# EAGLE design avip-mod v3 (EAGLE 9.6.2)
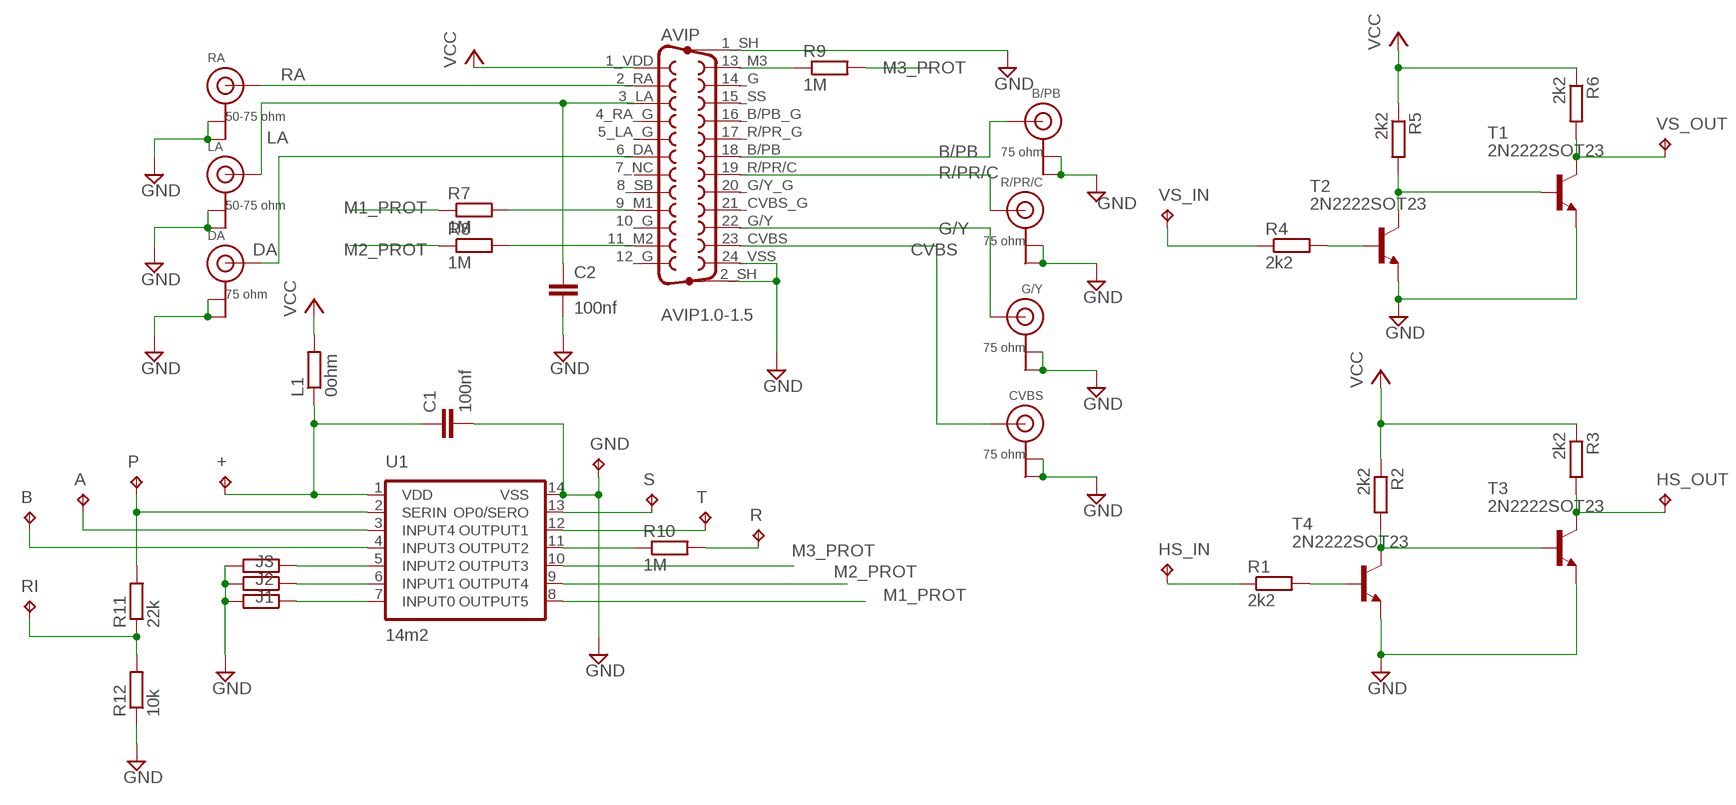
[diagram p0: schematic, sheet 1]

## Parts
+  TPTP07SQ  [TP07SQ]
A  TPTP07SQ  [TP07SQ]
AVIP  AVIP1.0-1.5  [AVIP-1.0-1.5]
B  TPTP07SQ  [TP07SQ]
B/PB  75 ohm  ANTENNA_U.FL  [U.FL]
C1  100nf  C-EUC0603  [C0603]
C2  100nf  C-EUC0603  [C0603]
CVBS  75 ohm  ANTENNA_U.FL  [U.FL]
DA  75 ohm  ANTENNA_U.FL  [U.FL]
G/Y  75 ohm  ANTENNA_U.FL  [U.FL]
GND  TPTP07SQ  [TP07SQ]
HS_IN  TPTP07SQ  [TP07SQ]
HS_OUT  TPTP07SQ  [TP07SQ]
J1  0ohm  R-EU_R0603  [R0603]
J2  0ohm  R-EU_R0603  [R0603]
J3  0ohm  R-EU_R0603  [R0603]
L1  0ohm  R-EU_R0603  [R0603]
LA  50-75 ohm  ANTENNA_U.FL  [U.FL]
P  TPTP07SQ  [TP07SQ]
R  TPTP07SQ  [TP07SQ]
R1  2k2  R-EU_R0603  [R0603]
R2  2k2  R-EU_R0603  [R0603]
R3  2k2  R-EU_R0603  [R0603]
R4  2k2  R-EU_R0603  [R0603]
R5  2k2  R-EU_R0603  [R0603]
R6  2k2  R-EU_R0603  [R0603]
R7  1M  R-EU_R0603  [R0603]
R8  1M  R-EU_R0603  [R0603]
R9  1M  R-EU_R0603  [R0603]
R10  1M  R-EU_R0603  [R0603]
R11  22k  R-EU_R0603  [R0603]
R12  10k  R-EU_R0603  [R0603]
R/PR/C  75 ohm  ANTENNA_U.FL  [U.FL]
RA  50-75 ohm  ANTENNA_U.FL  [U.FL]
RI  TPTP07SQ  [TP07SQ]
S  TPTP07SQ  [TP07SQ]
T  TPTP07SQ  [TP07SQ]
T1  2N2222SOT23  [SOT23]
T2  2N2222SOT23  [SOT23]
T3  2N2222SOT23  [SOT23]
T4  2N2222SOT23  [SOT23]
U1  14m2  PICAXE-14AXE017M2SM  [SO14]
VS_IN  TPTP07SQ  [TP07SQ]
VS_OUT  TPTP07SQ  [TP07SQ]

## Nets
A: A.TP U1.3(INPUT4)
B: B.TP U1.4(INPUT3)
B/PB [video length]: AVIP.18_B/PB B/PB.3(SIGNAL)
CVBS: AVIP.23_CVBS CVBS.3(SIGNAL)
DA: AVIP.6_DA DA.3(SIGNAL)
G/Y [video length]: AVIP.22_G/Y G/Y.3(SIGNAL)
GND: AVIP.1_SH AVIP.2_SH AVIP.24_VSS B/PB.1(GND) B/PB.2(GND) C1.2 C2.2 CVBS.1(GND) CVBS.2(GND) DA.1(GND) DA.2(GND) G/Y.1(GND) G/Y.2(GND) GND.TP J1.2 J2.2 J3.2 LA.1(GND) LA.2(GND) R12.1 R/PR/C.1(GND) R/PR/C.2(GND) RA.1(GND) RA.2(GND) T1.3(E) T2.3(E) T3.3(E) T4.3(E) U1.14(VSS)
H_SYNC_3V: R2.2 T3.1(B) T4.2(C)
H_SYNC_IN: HS_IN.TP R1.1
H_SYNC_IN_PROT: R1.2 T4.1(B)
H_SYNC_OUT: HS_OUT.TP R3.2 T3.2(C)
LA: AVIP.3_LA C2.1 LA.3(SIGNAL)
M1: AVIP.9_M1 R7.2
M1_PROT: R7.1 U1.8(OUTPUT5)
M1S: J1.1 U1.7(INPUT0)
M2: AVIP.11_M2 R8.2
M2_PROT: R8.1 U1.9(OUTPUT4)
M2S: J2.1 U1.6(INPUT1)
M3: AVIP.13_M3 R9.1
M3_PROT: R9.2 U1.10(OUTPUT3)
M3S: J3.1 U1.5(INPUT2)
PROG: P.TP R11.2 U1.2(SERIN)
R/PR/C [video length]: AVIP.19_R/PR/C R/PR/C.3(SIGNAL)
RA: AVIP.2_RA RA.3(SIGNAL)
RESET: R10.2 R.TP
RESET_PROT: R10.1 U1.11(OUTPUT2)
RING: R11.1 R12.2 RI.TP
SPEAK: S.TP U1.13(OP0/SERO)
TOGGLE: T.TP U1.12(OUTPUT1)
V_SYNC_3V: R5.2 T1.1(B) T2.2(C)
V_SYNC_IN: R4.1 VS_IN.TP
V_SYNC_IN_PROT: R4.2 T2.1(B)
V_SYNC_OUT: R6.2 T1.2(C) VS_OUT.TP
VCC: AVIP.1_VDD L1.2 R2.1 R3.1 R5.1 R6.1
VDD: +.TP C1.1 L1.1 U1.1(VDD)
Unconnected: AVIP.4_RA_G AVIP.5_LA_G AVIP.7_NC AVIP.8_SB AVIP.10_G AVIP.12_G AVIP.14_G AVIP.15_SS AVIP.16_B/PB_G AVIP.17_R/PR_G AVIP.20_G/Y_G AVIP.21_CVBS_G

## Library data of the parts
+ A B GND HS_IN HS_OUT P R RI S T VS_IN VS_OUT = testpad:TP: Test pad
AVIP = XBOX:AVIP
B/PB CVBS DA G/Y LA R/PR/C RA = adafruit:ANTENNA_U.FL: U.FL Antenna Connector
C1 C2 = rcl:C-EU: CAPACITOR, European symbol; SPICEPREFIX: C
J1-J3 L1 R1-R12 = rcl:R-EU_: RESISTOR, European symbol; SPICEPREFIX: R
T1-T4 = adafruit:2N2222: NPN TRANSISTOR Big oval pads
U1 = picaxe-4:PICAXE-14

## Net classes
0 standard: width 0.25 mm, clearance 0.205 mm
1 video length: width 0.006 mm

## Board
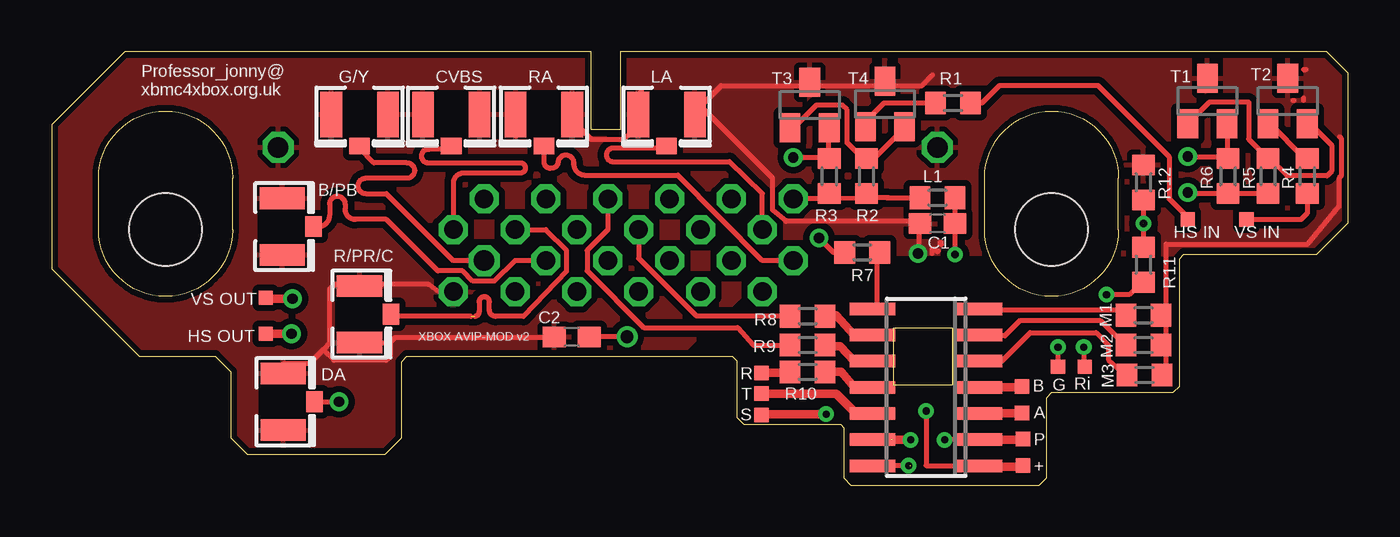
[diagram p1: board, top side]
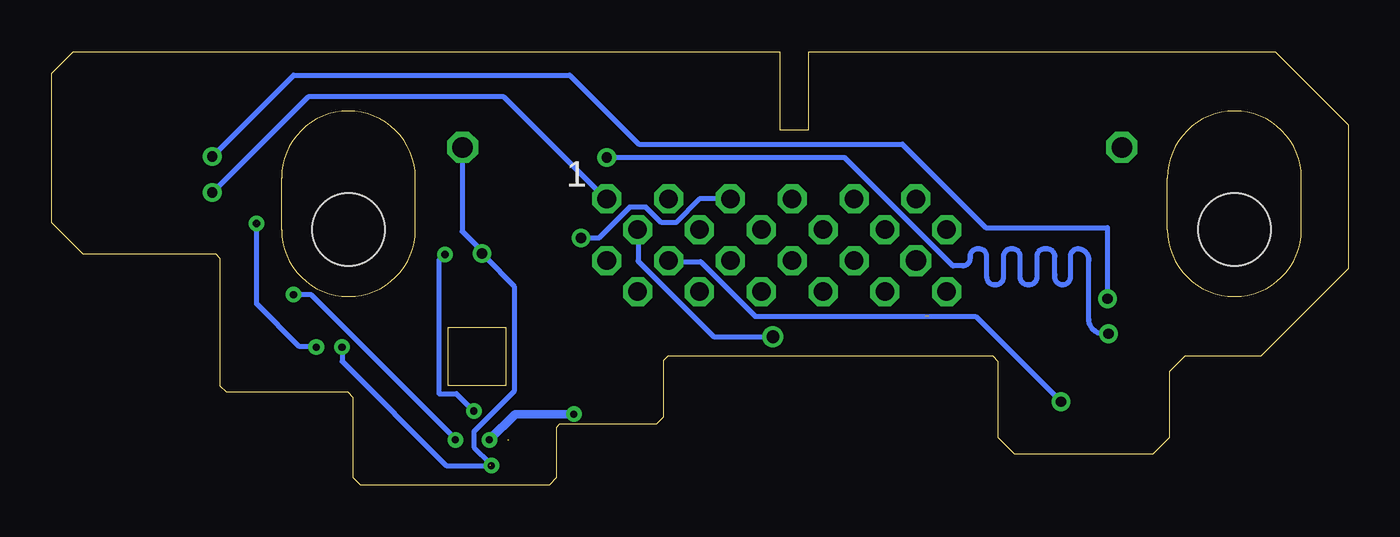
[diagram p2: board, bottom side, seen from below]

Size 62.95 x 21.05 mm. Coordinates in mm from the lower left corner, seen from the top.
Outline: 33.05,6.25 33.25,6.05 33.25,3.3 33.6,2.95 38.3,2.95 38.45,2.8 38.45,0.35 38.8,0 47.95,0 48.3,0.35 48.3,4.25 48.55,4.5 54.45,4.5 54.75,4.8 54.75,11 54.95,11.2 61.4,11.2 62.95,12.75 62.95,20 61.9,21.05 27.6,21.05 27.6,17.25 26.2,17.25 26.2,21.05 3.55,21.05 0,17.5 0,10.5 4.25,6.25 7.95,6.25 8.7,5.5 8.7,2.3 9.5,1.5 16.2,1.5 17,2.3 17,6 17.25,6.25 33.05,6.25
Copper layers (1*16): Top 0.035mm / dielectric 1.5mm / Bottom 0.035mm
Design rules "default *": minimum track width 10mil, minimum drill 24mil, track to track 8mil, track to pad 8mil, pad to pad 8mil, via to via 8mil, smd to smd 8mil, copper to edge 8mil, drill to drill 8mil, minimum pad ring 10mil, minimum via ring 8mil, stop-mask expansion 4mil, vias tented up to drill 15mil, thermal gap 10mil
Milling: 4 lines

### Footprints (pad centres in the part's own frame; a part is rotated, then mirrored left to right if it is on the bottom)
TP07SQ = smd 0.7 x 0.7: TP 0,0
AVIP-1.0-1.5 = drill 1 octagon: 1_SH -35.5,7; 2_SH -3.5,7; 22_G/Y -13.5,1.5 | drill 0.9 octagon: 1_VDD -28.5,4.5; 2_RA -28.5,1.5; 3_LA -27,3; 4_RA_G -27,0; 5_LA_G -25.5,4.5; 6_DA -25.5,1.5; 7_NC -24,3; 8_SB -24,0; 9_M1 -22.5,4.5; 10_G -22.5,1.5; 11_M2 -21,3; 12_G -21,0; 13_M3 -19.5,4.5; 14_G -19.5,1.5; 15_SS -18,3; 16_B/PB_G -18,0; 17_R/PR_G -16.5,4.5; 18_B/PB -16.5,1.5; 19_R/PR/C -15,3; 20_G/Y_G -15,0; 21_CVBS_G -13.5,4.5; 23_CVBS -12,3; 24_VSS -12,0 | hole 3.5: -41.035,3.01; 1.965,3.01
U.FL = smd 2.2 x 1.05: 1 0,1.375; 2 0,-1.375 | smd 0.8 x 1: 3 1.525,0
C0603 = smd 1.1 x 1: 1 -0.85,0; 2 0.85,0
R0603 = smd 1 x 1.1: 1 -0.85,0; 2 0.85,0
SOT23 = smd 1 x 1.4: 1 -0.95,-1.1; 2 0.95,-1.1; 3 0,1.1
SO14 = smd 0.6 x 2.2: 1 -3.81,-2.6; 2 -2.54,-2.6; 3 -1.27,-2.6; 4 0,-2.6; 5 1.27,-2.6; 6 2.54,-2.6; 7 3.81,-2.6; 8 3.81,2.6; 9 2.54,2.6; 10 1.27,2.6; 11 0,2.6; 12 -1.27,2.6; 13 -2.54,2.6; 14 -3.81,2.6

### Placement (x,y rotation side)
+  47.15,0.95 0 top
A  47.1,3.5 0 top
AVIP  7.5,9.4 0 bottom
B  47.1,4.8 0 top
B/PB  11.2,12.55 0 top
C1  43,12.7 180 top
C2  25.25,7.2 180 top
CVBS  19.4,18 270 top
DA  11.25,4.05 0 top
G/Y  14.95,18 270 top
GND  48.85,5.75 0 top
HS_IN  55.15,12.9 180 top
HS_OUT  10.4,7.35 180 top
J1  53,8.25 0 top
J2  53,6.8 0 top
J3  53.05,5.35 0 top
L1  43,13.95 180 top
LA  29.85,18 270 top
P  47.15,2.25 0 top
R  34.45,5.45 0 top
R1  43.75,18.55 180 top
R2  39.55,15 90 top
R3  37.75,15 90 top
R4  60.95,15 90 top
R5  59.05,15 90 top
R6  57.1,15 90 top
R7  39.35,11.3 180 top
R8  36.7,8.2 180 top
R9  36.7,6.8 0 top
R10  36.7,5.5 180 top
R11  53,10.7 270 top
R12  53,14.7 270 top
R/PR/C  14.95,8.3 0 top
RA  23.9,18 270 top
RI  50.15,5.75 0 top
S  34.45,3.4 0 top
T  34.45,4.45 0 top
T1  56.1,18.65 0 top
T2  60,18.65 0 top
T3  36.8,18.45 0 top
T4  40.45,18.5 0 top
U1  42.45,4.75 90 top
VS_IN  58,12.9 180 top
VS_OUT  10.4,9.1 180 top

### Tracks (layer width: path | path; a pad name or v marks a point on that pad's centre or on a via)
A
  Top 0.254: A.TP 47.1,3.53 47.05,3.5 | 45.3,3.5 45.15,3.53 U1.3
  Top 0.406: 45.3,3.5 47.05,3.5
B
  Top 0.254: B.TP 47.1,4.75 | 45.15,4.75 45.15,4.8 U1.4
  Top 0.406: U1.4 45.15,4.75 47.1,4.75
B/PB
  Top 0.254: AVIP.18_B/PB 22.5,10.9 21.5,9.9 20.45,9.9 19.95,10.4 18.75,10.4 16.25,12.9 14.75,12.9 arc-90 14.25,13.4 14.25,13.65 arc180 13.5,13.65 13.5,13.1 arc-90 12.95,12.55 12.8,12.55 12.68,12.6 B/PB.3
CVBS
  Top 0.254: AVIP.23_CVBS 19.5,14.65 arc-90 20,15.15 22.75,15.15 arc180 22.75,15.65 18.25,15.65 arc-180 18.32,16.3 19.45,16.3 19.45,16.39 CVBS.3
DA  (via drill 0.5)
  Top 0.254: DA.3 v13.95,4.05
  Bottom 0.254: v13.95,4.05 18.1,8.2 28.8,8.2 31.45,10.85 32.92,10.85 32.99,10.88 AVIP.6_DA
G/Y
  Top 0.254: AVIP.22_G/Y 19.5,10.9 16.25,14.15 15.25,14.15 arc-180 15.25,14.9 17.25,14.9 arc180 17.25,15.65 15.65,15.65 14.95,16.35 14.98,16.39 G/Y.3
GND  (via drill 0.35, 0.5)  (1 unrouted)
  Top 0.254: 42.75,19.9 42.25,19.4 32.5,19.4 31.5,18.4 35,14.9 35,13.35 35.65,12.8 35.74,12.83 41.86,12.83 C1.2 42.1,12.71 42.1,11.3 v42.05,11.25 42.28,11.34 42.28,11.25 | 54.1,6.86 54.1,5.37 53.99,5.37 J3.2 | 54.1,6.86 54.1,8.35 | 54.1,8.35 54.1,11.7 60.97,11.7 62.45,13.5 62.48,13.52 62.48,14.9 62.6,15.01 62.6,16.85 62.52,16.91 | AVIP.24_VSS 18.8,9.4 18.3,9.75 13.75,9.75 13.48,9.48 13.48,6.98 13.53,6.93 13.19,6.59 | 15.8,6.85 15.85,6.9 16.45,6.9 16.45,6.27 16.24,6.06 13.71,6.06 13.19,6.59 | 13.19,6.59 12.5,5.9 11.25,5.9 | 41.67,0.95 40.65,0.95 40.56,1.01 39.88,1.01 U1.14 | v48.85,6.7 GND.TP | 54.1,8.35 53.88,8.35 J1.2 | 54.1,6.86 53.88,6.86 J2.2 | 28.63,19.14 28.6,19.14 | 31.61,17.99 LA.1 | 31.15,17.07 LA.1 | 31.38,18.11 LA.1 | 36.66,19.6 T3.3 | 60.76,20.17 60.88,20.17 | 60.76,18.8 60.76,18.68 | 25.27,17.47 RA.1 25.27,17.7 25.67,17.3 25.67,17.31 26.2,16.79 27.79,16.79 28.2,17.2 28.17,17.3 28.17,17.76 28.4,17.99 LA.2 | 22.55,16.96 RA.2 | 41.66,0.96 v41.6,0.95 | 42.86,11.47 42.74,11.45 42.74,11.25 | 42.97,11.34 43.04,11.36 | 43.17,11.78 43.12,11.77 43.2,11.68 | 24.61,7.15 16.65,7.15 16.43,6.93 | 60.3,18.68 60.26,18.67 | T2.3 59.96,19.71 59.88,19.63
  Bottom 0.254: v48.85,6.7 48.85,6.01 43.79,0.95 v41.6,0.95 41.75,0.98 41.66,1.06 42.45,1.85 42.45,2.6 40.5,4.55 40.5,9.65 41.9,11.1 v42.05,11.25 42,11.3 43.02,12.32 43.02,16.38 AVIP.1_SH
  pour Top (isolate 0.305): 0,17.5 0,10.5 4.23,6.25 7.93,6.23 8.7,5.5 8.74,2.29 9.5,1.52 16.26,1.52 17,2.32 17.01,5.98 17.29,6.25 30.37,6.26 35.56,11.26 61.4,11.2 62.95,12.8 62.95,19.95 61.95,21.05 27.6,21.05 27.6,17.25 26.2,17.25 26.2,21.05 3.55,21
H_SYNC_3V
  Top 0.254: T4.2 41.37,17.3 39.99,15.93 39.73,15.93 R2.2 39.14,16.08 38.61,16.62 38.61,18.22 38.38,18.45 37.12,18.45 36.09,17.42 35.86,17.42 T3.1
H_SYNC_IN
  Top 0.254: HS_IN.TP 55.15,13 54.25,13.9 54.25,15.95 50.8,19.4 46,19.4 45.15,18.55 R1.1
H_SYNC_IN_PROT
  Top 0.254: R1.2 40.4,18.55 39.5,17.65 T4.1
H_SYNC_OUT  (via drill 0.5 pad 0.25)
  Top 0.254: v36,15.9 37.7,15.9 R3.2 37.71,15.89 37.71,17.31 T3.2
  Top 0.406: v11.65,7.35 HS_OUT.TP
  Bottom 0.254: v11.65,7.35 11.91,7.35 arc90 12.6,8.04 12.6,10.9 arc-90 13.12,11.48 | 13.12,11.48 13.12,11.48 arc0 13.12,11.48 | 13.12,11.48 arc-90 13.5,11.1 13.5,10.11 arc90 13.88,9.72 13.93,9.72 arc90 14.25,10.22 14.25,11.11 arc-90 14.7,11.48 14.74,11.48 arc-90 15.12,11.1 15.12,10.11 arc90 15.51,9.72 15.55,9.72 arc90 15.94,10.11 15.94,11.1 arc-90 16.32,11.48 16.37,11.48 arc-90 16.75,11.1 16.75,10.11 arc90 17.13,9.72 17.18,9.72 arc90 17.56,10.11 17.56,11.1 arc-90 17.94,11.48 17.99,11.48 arc-90 18.37,11.1 18.37,11 arc90 18.72,10.65 19.2,10.65 24.45,15.9 v36,15.9
LA  (via drill 0.61)
  Top 0.254: AVIP.3_LA 34.5,14.15 32.9,15.7 27.2,15.7 arc-143 27.15,16.35 29.74,16.35 29.78,16.5 LA.3 | v27.94,7.21 C2.1
  Bottom 0.254: v27.94,7.21 30.81,7.21 34.48,10.88 34.48,12.37 AVIP.3_LA
M1  (via drill 0.5)
  Top 0.254: v37.25,12 37.95,11.3 R7.2 | R7.2 38.5,11.34 R7.2
  Bottom 0.254: v37.25,12 36.38,12 34.9,13.5 34.1,13.5 33.35,12.75 32.65,12.75 31.5,13.9 AVIP.9_M1 30.01,13.86 AVIP.9_M1
M1_PROT
  Top 0.254: R7.1 40.1,11.34 40.05,11.34 40.05,8.58 39.99,8.58 U1.8
M1S
  Top 0.254: J1.1 52.04,8.35 52.04,8.47 51.93,8.5 45.2,8.5 45.15,8.47 U1.7
M2
  Top 0.254: AVIP.11_M2 28.5,11.01 31.3,8.21 35.8,8.21 35.98,8.29 R8.2
M2_PROT
  Top 0.254: U1.9 39.76,7.32 39.07,7.32 38.97,7.28 | 37.51,8.25 R8.1
  Top 0.406: 38.97,7.28 38.09,8.25 37.51,8.25
M2S
  Top 0.254: J2.1 52.04,6.86 50.9,8 47.02,8 46.27,7.25 45.6,7.25 45.5,7.32 45.15,7.32 U1.6
M3
  Top 0.254: AVIP.13_M3 27,12.4 26,11.4 26,10.4 28.75,7.65 33.3,7.65 34.05,6.8 R9.1
M3_PROT
  Top 0.254: 38.97,6.02 39.07,6.06 39.76,6.06 U1.10 | R9.2 37.58,6.86 37.58,6.75
  Top 0.406: 38.97,6.02 38.29,6.75 37.58,6.75
M3S
  Top 0.254: J3.1 52.06,5.41 51.5,5.9 51.3,6.1 51.3,6.8 50.7,7.4 47.5,7.4 46.12,6.02 46.07,6.06 45.73,6.06 | 45.73,6.06 45.15,6.06 U1.5 45.73,6.06
PROG  (via drill 0.35)
  Top 0.254: v51.2,9.25 52.3,9.25 52.8,9.75 52.89,9.95 R11.2 | 45.15,2.2 45.15,2.27 U1.2 44.81,2.16 44.47,2.16 44.35,2.2 v43.35,2.2 | P.TP 47.22,2.27 47.15,2.2
  Top 0.406: 45.15,2.2 47.15,2.2
  Bottom 0.254: v43.35,2.2 43.35,2.25 50.35,9.25 v51.2,9.25
R/PR/C  (1 unrouted)
  Top 0.254: AVIP.19_R/PR/C 24,12.4 25,11.4 25,10.4 22.9,8.2 21.55,8.2 arc-90 21.25,8.5 21.25,8.9 arc90 21,9.15 arc90 20.75,8.9 20.75,8.42 arc-91 20.55,8.2 | 20.37,8.2 16.57,8.2 R/PR/C.3
RA
  Top 0.254: AVIP.2_RA 34.5,10.9 30.4,15.05 25.85,15.05 arc-90 25.35,15.63 arc90 24.96,16.02 arc90 24.59,15.65 arc-90 24.25,15.4 arc-90 23.9,15.63 23.9,16.4 23.93,16.5 RA.3
RESET
  Top 0.254: R.TP 34.48,5.49 34.6,5.45 | 35.74,5.45 35.74,5.49 R10.2
  Top 0.406: 35.74,5.45 34.6,5.45
RESET_PROT
  Top 0.254: 39,4.74 39.07,4.8 39.76,4.8 U1.11 | R10.1 37.58,5.6 37.58,5.5
  Top 0.406: 37.58,5.5 38.34,5.5 39,4.74
RING  (via drill 0.35)  (1 unrouted)
  Top 0.254: R12.2 53,12.72 | v52.99,12.71 v53,12.7 R11.1 | v50.1,6.7 50.1,5.82 50.2,5.83 RI.TP
  Bottom 0.254: v50.1,6.7 50.15,6.75 50.95,6.75 53,8.8 v53,12.7
SPEAK  (via drill 0.35)  (1 unrouted)
  Top 0.254: 37.4,3.45 37.58,3.53 v37.6,3.45 | S.TP 34.48,3.42 34.6,3.45 | 40.75,2.2 40.68,2.27 39.88,2.27 U1.13
  Top 0.406: 34.6,3.45 37.4,3.45 | v41.7,2.2 40.8,2.2
  Bottom 0.406: v41.7,2.2 40.45,3.45 v37.6,3.45
TOGGLE
  Top 0.254: 38.99,3.53 39.76,3.53 U1.12 | 34.45,4.44 T.TP
  Top 0.406: 34.45,4.44 38.08,4.44 38.99,3.53
V_SYNC_3V
  Top 0.254: T2.2 60.99,17.65 62.14,16.5 62.14,15.24 61.91,15.01 59.97,15.01 59.16,15.81 59.15,15.81 R5.2 58.1,16.8 58.1,18.6 56.2,18.6 56.17,18.57 55.25,17.65 T1.1
V_SYNC_IN
  Top 0.254: VS_IN.TP 60.65,12.9 60.95,13.2 R4.1
V_SYNC_IN_PROT
  Top 0.254: R4.2 60.85,15.93 60.76,15.93 59.15,17.53 T2.1
V_SYNC_OUT  (via drill 0.5 pad 0.25)
  Top 0.254: T1.2 57.07,17.54 57.07,15.88 R6.2 57.09,15.93 57.09,15.95 v55.15,15.95
  Top 0.406: v11.7,9.05 10.45,9.05 VS_OUT.TP
  Bottom 0.254: v55.15,15.95 51.2,19.9 37.8,19.9 34.45,16.55 21.65,16.55 17.6,12.5 11.7,12.5 v11.7,9.05
VCC  (via drill 0.5)
  Top 0.254: R5.1 R6.1 55.2,14.15 v55.15,14.2 | 40.55,13.95 40.65,13.95 L1.2 | 40.55,13.95 39.3,13.95 | 37.81,13.91 39.3,13.92 39.3,13.95 | 37.81,13.91 36.09,13.9 36.09,13.86 AVIP.1_VDD | 40.55,13.95 | R3.1 37.81,14.09 37.81,13.98 37.81,13.91 | 39.3,13.95 39.3,13.98 39.5,14.17 R2.1 | L1.2
  Bottom 0.254: AVIP.1_VDD 36.05,13.9 41,18.85 50.5,18.85 v55.15,14.2
VDD  (via drill 0.35)
  Top 0.254: L1.1 C1.1 v43.85,11.2 | v42.45,3.6 42.45,0.95 45,0.95 45.04,1.01 U1.1 45.15,1.01 45.15,0.9 | +.TP 47.22,1.01 47.2,0.9
  Top 0.406: 45.15,0.9 47.2,0.9
  Bottom 0.254: v43.85,11.2 44.15,10.9 44.15,4.45 43.3,4.45 v42.45,3.6

### Text on the board
tNames: Professor_jonny@ / xbmc4xbox.org.uk | HS IN | VS IN | VS OUT | M1 | HS OUT | XBOX AVIP-MOD v2 | M2 | R | B | G | Ri | M3 | T | A | S | P | +